# Altium schematic sheet Main.SchDoc: Main
size A3; Author: Arjan Blankestijn; Revision: V1; SheetNumber: 1; SheetTotal: 2; Author2: Bram Bremer; Team: 2024; ProjectPrettyName: BMS; Subsystem: Module Board
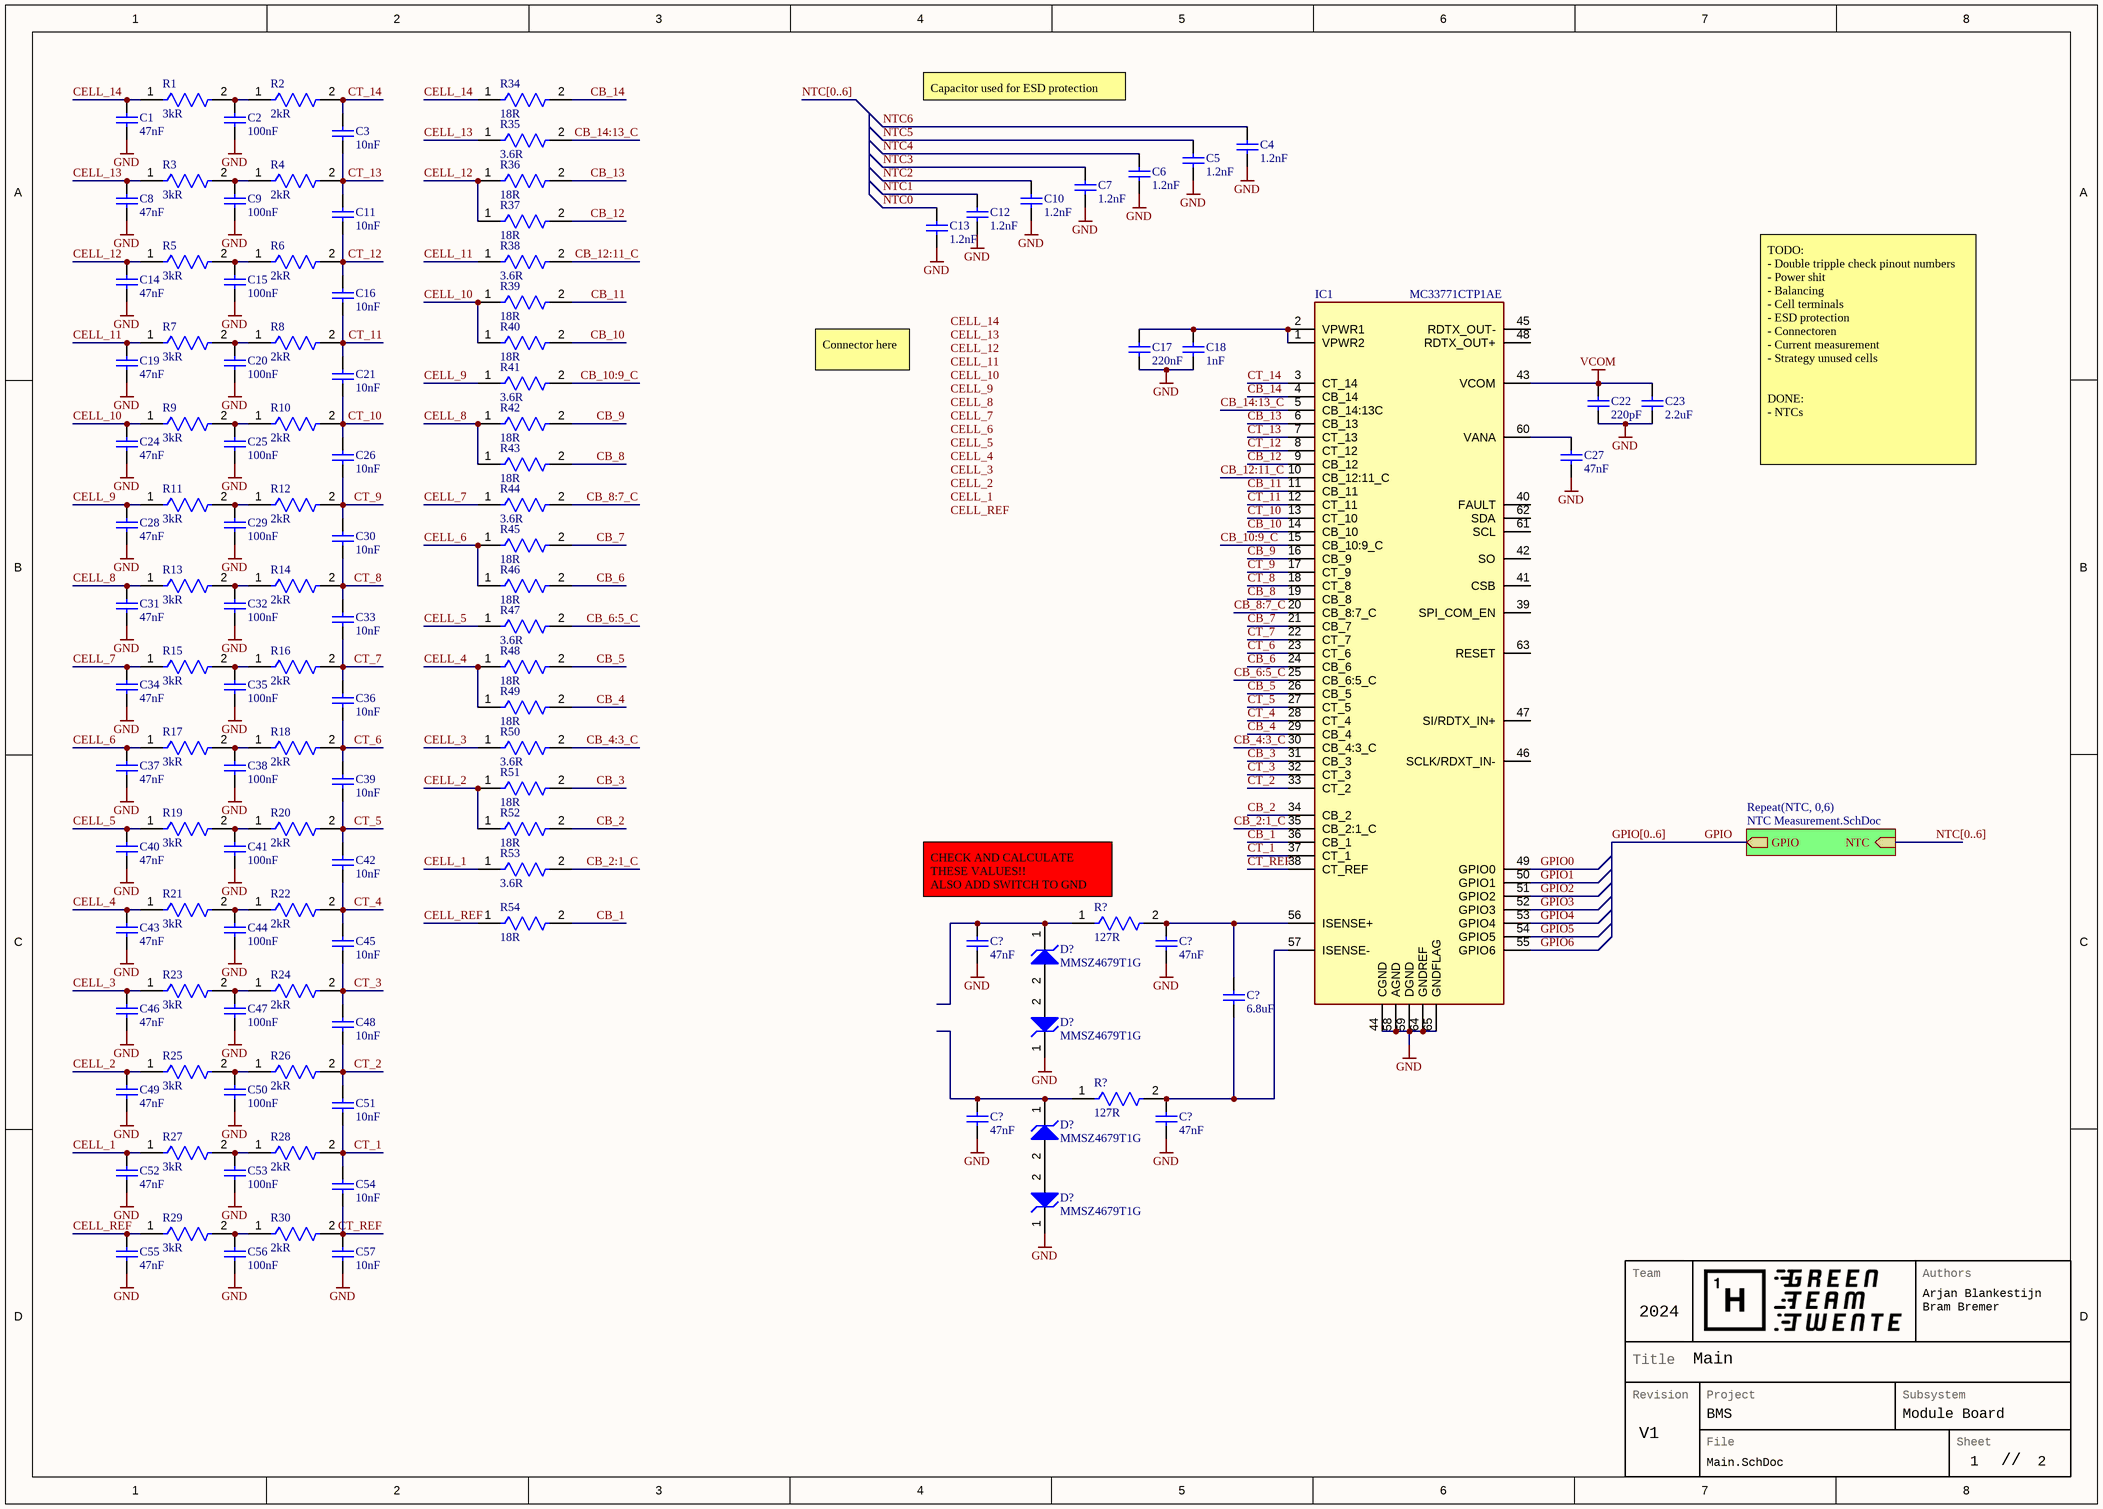
[diagram p0: Main.SchDoc]

## Parts
(Parts that share a designator on the sheet are numbered #1, #2 ... from top to bottom, then left to right.)
C1  value 47nF  [WCAP-CSGP_0402_L1W0.5H0.5]  (hidden comment: 47nF 0402 C_NTC)
C2  value 100nF  [WCAP-CSGP_0402_L1W0.5H0.5]  (hidden comment: 100nF 0402 C_NTC)
C3  value 10nF  [WCAP-CSGP_0402_L1W0.5H0.5]  (hidden comment: 10nF 0402 C_NTC)
C4  value 1.2nF  [WCAP-CSGP_0402_L1W0.5H0.5]  (hidden comment: 1.2nF 0402 C_NTC)
C5  value 1.2nF  [WCAP-CSGP_0402_L1W0.5H0.5]  (hidden comment: 1.2nF 0402 C_NTC)
C6  value 1.2nF  [WCAP-CSGP_0402_L1W0.5H0.5]  (hidden comment: 1.2nF 0402 C_NTC)
C7  value 1.2nF  [WCAP-CSGP_0402_L1W0.5H0.5]  (hidden comment: 1.2nF 0402 C_NTC)
C8  value 47nF  [WCAP-CSGP_0402_L1W0.5H0.5]  (hidden comment: 47nF 0402 C_NTC)
C9  value 100nF  [WCAP-CSGP_0402_L1W0.5H0.5]  (hidden comment: 100nF 0402 C_NTC)
C10  value 1.2nF  [WCAP-CSGP_0402_L1W0.5H0.5]  (hidden comment: 1.2nF 0402 C_NTC)
C11  value 10nF  [WCAP-CSGP_0402_L1W0.5H0.5]  (hidden comment: 10nF 0402 C_NTC)
C12  value 1.2nF  [WCAP-CSGP_0402_L1W0.5H0.5]  (hidden comment: 1.2nF 0402 C_NTC)
C13  value 1.2nF  [WCAP-CSGP_0402_L1W0.5H0.5]  (hidden comment: 1.2nF 0402 C_NTC)
C14  value 47nF  [WCAP-CSGP_0402_L1W0.5H0.5]  (hidden comment: 47nF 0402 C_NTC)
C15  value 100nF  [WCAP-CSGP_0402_L1W0.5H0.5]  (hidden comment: 100nF 0402 C_NTC)
C16  value 10nF  [WCAP-CSGP_0402_L1W0.5H0.5]  (hidden comment: 10nF 0402 C_NTC)
C17  value 220nF  [WCAP-CSGP_0402_L1W0.5H0.5]  (hidden comment: 220nF 0402 C_NTC)
C18  value 1nF  [WCAP-CSGP_0402_L1W0.5H0.5]  (hidden comment: 1nF 0402 C_NTC)
C19  value 47nF  [WCAP-CSGP_0402_L1W0.5H0.5]  (hidden comment: 47nF 0402 C_NTC)
C20  value 100nF  [WCAP-CSGP_0402_L1W0.5H0.5]  (hidden comment: 100nF 0402 C_NTC)
C21  value 10nF  [WCAP-CSGP_0402_L1W0.5H0.5]  (hidden comment: 10nF 0402 C_NTC)
C22  value 220pF  [WCAP-CSGP_0402_L1W0.5H0.5]  (hidden comment: 220pF 0402 C_NTC)
C23  value 2.2uF  [WCAP-CSGP_0402_L1W0.5H0.5]  (hidden comment: 2.2uF 0402 C_NTC)
C24  value 47nF  [WCAP-CSGP_0402_L1W0.5H0.5]  (hidden comment: 47nF 0402 C_NTC)
C25  value 100nF  [WCAP-CSGP_0402_L1W0.5H0.5]  (hidden comment: 100nF 0402 C_NTC)
C26  value 10nF  [WCAP-CSGP_0402_L1W0.5H0.5]  (hidden comment: 10nF 0402 C_NTC)
C27  value 47nF  [WCAP-CSGP_0402_L1W0.5H0.5]  (hidden comment: 47nF 0402 C_NTC)
C28  value 47nF  [WCAP-CSGP_0402_L1W0.5H0.5]  (hidden comment: 47nF 0402 C_NTC)
C29  value 100nF  [WCAP-CSGP_0402_L1W0.5H0.5]  (hidden comment: 100nF 0402 C_NTC)
C30  value 10nF  [WCAP-CSGP_0402_L1W0.5H0.5]  (hidden comment: 10nF 0402 C_NTC)
C31  value 47nF  [WCAP-CSGP_0402_L1W0.5H0.5]  (hidden comment: 47nF 0402 C_NTC)
C32  value 100nF  [WCAP-CSGP_0402_L1W0.5H0.5]  (hidden comment: 100nF 0402 C_NTC)
C33  value 10nF  [WCAP-CSGP_0402_L1W0.5H0.5]  (hidden comment: 10nF 0402 C_NTC)
C34  value 47nF  [WCAP-CSGP_0402_L1W0.5H0.5]  (hidden comment: 47nF 0402 C_NTC)
C35  value 100nF  [WCAP-CSGP_0402_L1W0.5H0.5]  (hidden comment: 100nF 0402 C_NTC)
C36  value 10nF  [WCAP-CSGP_0402_L1W0.5H0.5]  (hidden comment: 10nF 0402 C_NTC)
C37  value 47nF  [WCAP-CSGP_0402_L1W0.5H0.5]  (hidden comment: 47nF 0402 C_NTC)
C38  value 100nF  [WCAP-CSGP_0402_L1W0.5H0.5]  (hidden comment: 100nF 0402 C_NTC)
C39  value 10nF  [WCAP-CSGP_0402_L1W0.5H0.5]  (hidden comment: 10nF 0402 C_NTC)
C40  value 47nF  [WCAP-CSGP_0402_L1W0.5H0.5]  (hidden comment: 47nF 0402 C_NTC)
C41  value 100nF  [WCAP-CSGP_0402_L1W0.5H0.5]  (hidden comment: 100nF 0402 C_NTC)
C42  value 10nF  [WCAP-CSGP_0402_L1W0.5H0.5]  (hidden comment: 10nF 0402 C_NTC)
C43  value 47nF  [WCAP-CSGP_0402_L1W0.5H0.5]  (hidden comment: 47nF 0402 C_NTC)
C44  value 100nF  [WCAP-CSGP_0402_L1W0.5H0.5]  (hidden comment: 100nF 0402 C_NTC)
C45  value 10nF  [WCAP-CSGP_0402_L1W0.5H0.5]  (hidden comment: 10nF 0402 C_NTC)
C46  value 47nF  [WCAP-CSGP_0402_L1W0.5H0.5]  (hidden comment: 47nF 0402 C_NTC)
C47  value 100nF  [WCAP-CSGP_0402_L1W0.5H0.5]  (hidden comment: 100nF 0402 C_NTC)
C48  value 10nF  [WCAP-CSGP_0402_L1W0.5H0.5]  (hidden comment: 10nF 0402 C_NTC)
C49  value 47nF  [WCAP-CSGP_0402_L1W0.5H0.5]  (hidden comment: 47nF 0402 C_NTC)
C50  value 100nF  [WCAP-CSGP_0402_L1W0.5H0.5]  (hidden comment: 100nF 0402 C_NTC)
C51  value 10nF  [WCAP-CSGP_0402_L1W0.5H0.5]  (hidden comment: 10nF 0402 C_NTC)
C52  value 47nF  [WCAP-CSGP_0402_L1W0.5H0.5]  (hidden comment: 47nF 0402 C_NTC)
C53  value 100nF  [WCAP-CSGP_0402_L1W0.5H0.5]  (hidden comment: 100nF 0402 C_NTC)
C54  value 10nF  [WCAP-CSGP_0402_L1W0.5H0.5]  (hidden comment: 10nF 0402 C_NTC)
C55  value 47nF  [WCAP-CSGP_0402_L1W0.5H0.5]  (hidden comment: 47nF 0402 C_NTC)
C56  value 100nF  [WCAP-CSGP_0402_L1W0.5H0.5]  (hidden comment: 100nF 0402 C_NTC)
C57  value 10nF  [WCAP-CSGP_0402_L1W0.5H0.5]  (hidden comment: 10nF 0402 C_NTC)
C?#1  value 47nF  [WCAP-CSGP_0402_L1W0.5H0.5]  (hidden comment: 47nF 0402 C_NTC)
C?#2  value 47nF  [WCAP-CSGP_0402_L1W0.5H0.5]  (hidden comment: 47nF 0402 C_NTC)
C?#3  value 6.8uF  [WCAP-CSGP_0402_L1W0.5H0.5]  (hidden comment: 6.8uF 0402 C_NTC)
C?#4  value 47nF  [WCAP-CSGP_0402_L1W0.5H0.5]  (hidden comment: 47nF 0402 C_NTC)
C?#5  value 47nF  [WCAP-CSGP_0402_L1W0.5H0.5]  (hidden comment: 47nF 0402 C_NTC)
D?#1  MMSZ4679T1G  [ONSC-SOD-123-2-425-04_V]
D?#2  MMSZ4679T1G  [ONSC-SOD-123-2-425-04_V]
D?#3  MMSZ4679T1G  [ONSC-SOD-123-2-425-04_V]
D?#4  MMSZ4679T1G  [ONSC-SOD-123-2-425-04_V]
IC1  MC33771CTP1AE  [QFP50P1200X1200X160-65N]
R1  Resistance: 3kR  [FP-RT0402-0_35-MFG]  (hidden comment: 3kR 0402 0.1%)
R2  Resistance: 2kR  [FP-RT0402-0_35-MFG]  (hidden comment: 2kR 0402 0.1%)
R3  Resistance: 3kR  [FP-RT0402-0_35-MFG]  (hidden comment: 3kR 0402 0.1%)
R4  Resistance: 2kR  [FP-RT0402-0_35-MFG]  (hidden comment: 2kR 0402 0.1%)
R5  Resistance: 3kR  [FP-RT0402-0_35-MFG]  (hidden comment: 3kR 0402 0.1%)
R6  Resistance: 2kR  [FP-RT0402-0_35-MFG]  (hidden comment: 2kR 0402 0.1%)
R7  Resistance: 3kR  [FP-RT0402-0_35-MFG]  (hidden comment: 3kR 0402 0.1%)
R8  Resistance: 2kR  [FP-RT0402-0_35-MFG]  (hidden comment: 2kR 0402 0.1%)
R9  Resistance: 3kR  [FP-RT0402-0_35-MFG]  (hidden comment: 3kR 0402 0.1%)
R10  Resistance: 2kR  [FP-RT0402-0_35-MFG]  (hidden comment: 2kR 0402 0.1%)
R11  Resistance: 3kR  [FP-RT0402-0_35-MFG]  (hidden comment: 3kR 0402 0.1%)
R12  Resistance: 2kR  [FP-RT0402-0_35-MFG]  (hidden comment: 2kR 0402 0.1%)
R13  Resistance: 3kR  [FP-RT0402-0_35-MFG]  (hidden comment: 3kR 0402 0.1%)
R14  Resistance: 2kR  [FP-RT0402-0_35-MFG]  (hidden comment: 2kR 0402 0.1%)
R15  Resistance: 3kR  [FP-RT0402-0_35-MFG]  (hidden comment: 3kR 0402 0.1%)
R16  Resistance: 2kR  [FP-RT0402-0_35-MFG]  (hidden comment: 2kR 0402 0.1%)
R17  Resistance: 3kR  [FP-RT0402-0_35-MFG]  (hidden comment: 3kR 0402 0.1%)
R18  Resistance: 2kR  [FP-RT0402-0_35-MFG]  (hidden comment: 2kR 0402 0.1%)
R19  Resistance: 3kR  [FP-RT0402-0_35-MFG]  (hidden comment: 3kR 0402 0.1%)
R20  Resistance: 2kR  [FP-RT0402-0_35-MFG]  (hidden comment: 2kR 0402 0.1%)
R21  Resistance: 3kR  [FP-RT0402-0_35-MFG]  (hidden comment: 3kR 0402 0.1%)
R22  Resistance: 2kR  [FP-RT0402-0_35-MFG]  (hidden comment: 2kR 0402 0.1%)
R23  Resistance: 3kR  [FP-RT0402-0_35-MFG]  (hidden comment: 3kR 0402 0.1%)
R24  Resistance: 2kR  [FP-RT0402-0_35-MFG]  (hidden comment: 2kR 0402 0.1%)
R25  Resistance: 3kR  [FP-RT0402-0_35-MFG]  (hidden comment: 3kR 0402 0.1%)
R26  Resistance: 2kR  [FP-RT0402-0_35-MFG]  (hidden comment: 2kR 0402 0.1%)
R27  Resistance: 3kR  [FP-RT0402-0_35-MFG]  (hidden comment: 3kR 0402 0.1%)
R28  Resistance: 2kR  [FP-RT0402-0_35-MFG]  (hidden comment: 2kR 0402 0.1%)
R29  Resistance: 3kR  [FP-RT0402-0_35-MFG]  (hidden comment: 3kR 0402 0.1%)
R30  Resistance: 2kR  [FP-RT0402-0_35-MFG]  (hidden comment: 2kR 0402 0.1%)
R34  Resistance: 18R  [FP-RT0402-0_35-MFG]  (hidden comment: 18R 0402 0.1%)
R35  Resistance: 3.6R  [FP-RT0402-0_35-MFG]  (hidden comment: 3.6R 0402 0.1%)
R36  Resistance: 18R  [FP-RT0402-0_35-MFG]  (hidden comment: 18R 0402 0.1%)
R37  Resistance: 18R  [FP-RT0402-0_35-MFG]  (hidden comment: 18R 0402 0.1%)
R38  Resistance: 3.6R  [FP-RT0402-0_35-MFG]  (hidden comment: 3.6R 0402 0.1%)
R39  Resistance: 18R  [FP-RT0402-0_35-MFG]  (hidden comment: 18R 0402 0.1%)
R40  Resistance: 18R  [FP-RT0402-0_35-MFG]  (hidden comment: 18R 0402 0.1%)
R41  Resistance: 3.6R  [FP-RT0402-0_35-MFG]  (hidden comment: 3.6R 0402 0.1%)
R42  Resistance: 18R  [FP-RT0402-0_35-MFG]  (hidden comment: 18R 0402 0.1%)
R43  Resistance: 18R  [FP-RT0402-0_35-MFG]  (hidden comment: 18R 0402 0.1%)
R44  Resistance: 3.6R  [FP-RT0402-0_35-MFG]  (hidden comment: 3.6R 0402 0.1%)
R45  Resistance: 18R  [FP-RT0402-0_35-MFG]  (hidden comment: 18R 0402 0.1%)
R46  Resistance: 18R  [FP-RT0402-0_35-MFG]  (hidden comment: 18R 0402 0.1%)
R47  Resistance: 3.6R  [FP-RT0402-0_35-MFG]  (hidden comment: 3.6R 0402 0.1%)
R48  Resistance: 18R  [FP-RT0402-0_35-MFG]  (hidden comment: 18R 0402 0.1%)
R49  Resistance: 18R  [FP-RT0402-0_35-MFG]  (hidden comment: 18R 0402 0.1%)
R50  Resistance: 3.6R  [FP-RT0402-0_35-MFG]  (hidden comment: 3.6R 0402 0.1%)
R51  Resistance: 18R  [FP-RT0402-0_35-MFG]  (hidden comment: 18R 0402 0.1%)
R52  Resistance: 18R  [FP-RT0402-0_35-MFG]  (hidden comment: 18R 0402 0.1%)
R53  Resistance: 3.6R  [FP-RT0402-0_35-MFG]  (hidden comment: 3.6R 0402 0.1%)
R54  Resistance: 18R  [FP-RT0402-0_35-MFG]  (hidden comment: 18R 0402 0.1%)
R?#1  Resistance: 127R  [FP-RT0402-0_35-MFG]  (hidden comment: 127R 0402 0.1%)
R?#2  Resistance: 127R  [FP-RT0402-0_35-MFG]  (hidden comment: 127R 0402 0.1%)

## Sub-sheets
Repeat(NTC, 0,6) = NTC Measurement.SchDoc: GPIO (out), NTC (in)

## Nets
GND: C1.1 C2.1 C4.1 C5.1 C6.1 C7.1 C8.1 C9.1 C10.1 C12.1 C13.1 C14.1 C15.1 C17.1 C18.1 C19.1 C20.1 C22.1 C23.1 C24.1 C25.1 C27.1 C28.1 C29.1 C31.1 C32.1 C34.1 C35.1 C37.1 C38.1 C40.1 C41.1 C43.1 C44.1 C46.1 C47.1 C49.1 C50.1 C52.1 C53.1 C55.1 C56.1 C57.1 C?#1.1 C?#2.1 C?#4.1 C?#5.1 D?#2.1(K) D?#4.1(K) IC1.44(CGND) IC1.58(AGND) IC1.59(DGND) IC1.64(GNDREF) IC1.65(GNDFLAG)
VCOM: C22.2 C23.2 IC1.43(VCOM)
CB_1: IC1.36(CB_1) R54.2
CB_2: IC1.34(CB_2) R52.2
CB_2:1_C: IC1.35(CB_2:1_C) R53.2
CB_3: IC1.31(CB_3) R51.2
CB_4: IC1.29(CB_4) R49.2
CB_4:3_C: IC1.30(CB_4:3_C) R50.2
CB_5: IC1.26(CB_5) R48.2
CB_6: IC1.24(CB_6) R46.2
CB_6:5_C: IC1.25(CB_6:5_C) R47.2
CB_7: IC1.21(CB_7) R45.2
CB_8: IC1.19(CB_8) R43.2
CB_8:7_C: IC1.20(CB_8:7_C) R44.2
CB_9: IC1.16(CB_9) R42.2
CB_10: IC1.14(CB_10) R40.2
CB_10:9_C: IC1.15(CB_10:9_C) R41.2
CB_11: IC1.11(CB_11) R39.2
CB_12: IC1.9(CB_12) R37.2
CB_12:11_C: IC1.10(CB_12:11_C) R38.2
CB_13: IC1.6(CB_13) R36.2
CB_14: IC1.4(CB_14) R34.2
CB_14:13_C: IC1.5(CB_14:13C) R35.2
CELL_1: C52.2 R27.1 R53.1
CELL_2: C49.2 R25.1 R51.1 R52.1
CELL_3: C46.2 R23.1 R50.1
CELL_4: C43.2 R21.1 R48.1 R49.1
CELL_5: C40.2 R19.1 R47.1
CELL_6: C37.2 R17.1 R45.1 R46.1
CELL_7: C34.2 R15.1 R44.1
CELL_8: C31.2 R13.1 R42.1 R43.1
CELL_9: C28.2 R11.1 R41.1
CELL_10: C24.2 R9.1 R39.1 R40.1
CELL_11: C19.2 R7.1 R38.1
CELL_12: C14.2 R5.1 R36.1 R37.1
CELL_13: C8.2 R3.1 R35.1
CELL_14: C1.2 R1.1 R34.1
CELL_REF: C55.2 R29.1 R54.1
CT_1: C51.1 C54.2 IC1.37(CT_1) R28.2
CT_2: C48.1 C51.2 IC1.33(CT_2) R26.2
CT_3: C45.1 C48.2 IC1.32(CT_3) R24.2
CT_4: C42.1 C45.2 IC1.28(CT_4) R22.2
CT_5: C39.1 C42.2 IC1.27(CT_5) R20.2
CT_6: C36.1 C39.2 IC1.23(CT_6) R18.2
CT_7: C33.1 C36.2 IC1.22(CT_7) R16.2
CT_8: C30.1 C33.2 IC1.18(CT_8) R14.2
CT_9: C26.1 C30.2 IC1.17(CT_9) R12.2
CT_10: C21.1 C26.2 IC1.13(CT_10) R10.2
CT_11: C16.1 C21.2 IC1.12(CT_11) R8.2
CT_12: C11.1 C16.2 IC1.8(CT_12) R6.2
CT_13: C3.1 C11.2 IC1.7(CT_13) R4.2
CT_14: C3.2 IC1.3(CT_14) R2.2
CT_REF: C54.1 C57.2 IC1.38(CT_REF) R30.2
GPIO: sheet Repeat(NTC, 0,6)/GPIO
GPIO0: IC1.49(GPIO0)
GPIO1: IC1.50(GPIO1)
GPIO2: IC1.51(GPIO2)
GPIO3: IC1.52(GPIO3)
GPIO4: IC1.53(GPIO4)
GPIO5: IC1.54(GPIO5)
GPIO6: IC1.55(GPIO6)
NTC0: C13.2
NTC1: C12.2
NTC2: C10.2
NTC3: C7.2
NTC4: C6.2
NTC5: C5.2
NTC6: C4.2
NetC2_2: C2.2 R1.2 R2.1
NetC9_2: C9.2 R3.2 R4.1
NetC15_2: C15.2 R5.2 R6.1
NetC17_2: C17.2 C18.2 IC1.1(VPWR2) IC1.2(VPWR1)
NetC20_2: C20.2 R7.2 R8.1
NetC25_2: C25.2 R9.2 R10.1
NetC27_2: C27.2 IC1.60(VANA)
NetC29_2: C29.2 R11.2 R12.1
NetC32_2: C32.2 R13.2 R14.1
NetC35_2: C35.2 R15.2 R16.1
NetC38_2: C38.2 R17.2 R18.1
NetC41_2: C41.2 R19.2 R20.1
NetC44_2: C44.2 R21.2 R22.1
NetC47_2: C47.2 R23.2 R24.1
NetC50_2: C50.2 R25.2 R26.1
NetC53_2: C53.2 R27.2 R28.1
NetC56_2: C56.2 R29.2 R30.1
NetC?#1_2: C?#1.2 D?#1.1(K) R?#1.1
NetC?#2_2: C?#2.2 C?#3.2 IC1.56(ISENSE+) R?#1.2
NetC?#3_1: C?#3.1 C?#5.2 IC1.57(ISENSE-) R?#2.2
NetC?#4_2: C?#4.2 D?#3.1(K) R?#2.1
NetD?#1_2: D?#1.2(A) D?#2.2(A)
NetD?#3_2: D?#3.2(A) D?#4.2(A)

Not connected (* = marked no-connect by the designer): IC1 39(SPI_COM_EN) 40(FAULT) 41(CSB) 42(SO) 45(RDTX_OUT-) 46(SCLK/RDXT_IN-) 47(SI/RDTX_IN+) 48(RDTX_OUT+) 61(SCL) 62(SDA) 63(RESET)

## Buses and harness runs
bus GPIO[0..6]
bus NTC[0..6]

## Notes on the sheet
- Capacitor used for ESD protection
- Connector here
- TODO:
  - Double tripple check pinout numbers
  - Power shit
  - Balancing
  - Cell terminals
  - ESD protection
  - Connectoren
  - Current measurement
  - Strategy unused cells
  DONE:
  - NTCs
- CHECK AND CALCULATE THESE VALUES!!
  ALSO ADD SWITCH TO GND
- Labels drawn without touching a wire or pin: CELL_1, CELL_2, CELL_3, CELL_4, CELL_5, CELL_6, CELL_7, CELL_8, CELL_9, CELL_10, CELL_11, CELL_12, CELL_13, CELL_14, CELL_REF
- Team
- Authors
- Revision
- Title
- Project
- Subsystem
- File
- Sheet
- //

## Library data of the parts
C1 C8 C14 C19 C24 C27 C28 C31 C34 C37 C40 C43 C46 C49 C52 C55 C?#1 C?#2 C?#4 C?#5 = CMP-001-00864-1: WCAP-CSGP Multilayer Ceramic Chip Capacitor, General Purpose, size 0402, X7R, 47nF, 50VDC; Manufacturer Part Number: 885012205092; Manufacturer: Wurth Elektronik; Dissipation Factor: 10%; Technical Reference: X7R0402104J050DFCT10000; Rated Voltage (DC): 50V; Capacitance Tolerance: +/-5%; Insulation Resistance: 0.5GO; Ceramic Type: X7R; Design Item ID: 885012205092; Operating Temperature Max: 125°C; Width: 0.5mm; ComponentLink2URL: https://www.we-online.com/redexpert/spec/885012205092?ad; Match Code: WCAP-CSGP; Mount: Surface Mount; ComponentLink1Description: Website Link; Height: 0.5mm; Component Type: Standard; Category: Multilayer Ceramic Chip Capacitors; ComponentLink1URL: https://www.we-online.com/redexpert/article/885012205092?ad; Source: WCAP-CSGP.SchLib; Packaging: Tape and Reel; Pins: 2; ComponentLink2Description: Datasheet Link; Operating Temperature Min: -55°C; Length: 1mm; Case/Package: 0402
C2 C9 C15 C20 C25 C29 C32 C35 C38 C41 C44 C47 C50 C53 C56 = CMP-001-00864-1: WCAP-CSGP Multilayer Ceramic Chip Capacitor, General Purpose, size 0402, X7R, 100nF, 50VDC; Manufacturer Part Number: 885012205092; Manufacturer: Wurth Elektronik; Dissipation Factor: 10%; Technical Reference: X7R0402104J050DFCT10000; Rated Voltage (DC): 50V; Capacitance Tolerance: +/-5%; Insulation Resistance: 0.5GO; Ceramic Type: X7R; Design Item ID: 885012205092; Operating Temperature Max: 125°C; Width: 0.5mm; ComponentLink2URL: https://www.we-online.com/redexpert/spec/885012205092?ad; Match Code: WCAP-CSGP; Mount: Surface Mount; ComponentLink1Description: Website Link; Height: 0.5mm; Component Type: Standard; Category: Multilayer Ceramic Chip Capacitors; ComponentLink1URL: https://www.we-online.com/redexpert/article/885012205092?ad; Source: WCAP-CSGP.SchLib; Packaging: Tape and Reel; Pins: 2; ComponentLink2Description: Datasheet Link; Operating Temperature Min: -55°C; Length: 1mm; Case/Package: 0402
C3 C11 C16 C21 C26 C30 C33 C36 C39 C42 C45 C48 C51 C54 C57 = CMP-001-00864-1: WCAP-CSGP Multilayer Ceramic Chip Capacitor, General Purpose, size 0402, X7R, 10nF, 50VDC; Manufacturer Part Number: 885012205092; Manufacturer: Wurth Elektronik; Dissipation Factor: 10%; Technical Reference: X7R0402104J050DFCT10000; Rated Voltage (DC): 50V; Capacitance Tolerance: +/-5%; Insulation Resistance: 0.5GO; Ceramic Type: X7R; Design Item ID: 885012205092; Operating Temperature Max: 125°C; Width: 0.5mm; ComponentLink2URL: https://www.we-online.com/redexpert/spec/885012205092?ad; Match Code: WCAP-CSGP; Mount: Surface Mount; ComponentLink1Description: Website Link; Height: 0.5mm; Component Type: Standard; Category: Multilayer Ceramic Chip Capacitors; ComponentLink1URL: https://www.we-online.com/redexpert/article/885012205092?ad; Source: WCAP-CSGP.SchLib; Packaging: Tape and Reel; Pins: 2; ComponentLink2Description: Datasheet Link; Operating Temperature Min: -55°C; Length: 1mm; Case/Package: 0402
C4-C7 C10 C12 C13 = CMP-001-00864-1: WCAP-CSGP Multilayer Ceramic Chip Capacitor, General Purpose, size 0402, X7R, 1.2nF, 50VDC; Manufacturer Part Number: 885012205092; Manufacturer: Wurth Elektronik; Dissipation Factor: 10%; Technical Reference: X7R0402104J050DFCT10000; Rated Voltage (DC): 50V; Capacitance Tolerance: +/-5%; Insulation Resistance: 0.5GO; Ceramic Type: X7R; Design Item ID: 885012205092; Operating Temperature Max: 125°C; Width: 0.5mm; ComponentLink2URL: https://www.we-online.com/redexpert/spec/885012205092?ad; Match Code: WCAP-CSGP; Mount: Surface Mount; ComponentLink1Description: Website Link; Height: 0.5mm; Component Type: Standard; Category: Multilayer Ceramic Chip Capacitors; ComponentLink1URL: https://www.we-online.com/redexpert/article/885012205092?ad; Source: WCAP-CSGP.SchLib; Packaging: Tape and Reel; Pins: 2; ComponentLink2Description: Datasheet Link; Operating Temperature Min: -55°C; Length: 1mm; Case/Package: 0402
C17 = CMP-001-00864-1: WCAP-CSGP Multilayer Ceramic Chip Capacitor, General Purpose, size 0402, X7R,220nF, 50VDC; Manufacturer Part Number: 885012205092; Manufacturer: Wurth Elektronik; Dissipation Factor: 10%; Technical Reference: X7R0402104J050DFCT10000; Rated Voltage (DC): 50V; Capacitance Tolerance: +/-5%; Insulation Resistance: 0.5GO; Ceramic Type: X7R; Design Item ID: 885012205092; Operating Temperature Max: 125°C; Width: 0.5mm; ComponentLink2URL: https://www.we-online.com/redexpert/spec/885012205092?ad; Match Code: WCAP-CSGP; Mount: Surface Mount; ComponentLink1Description: Website Link; Height: 0.5mm; Component Type: Standard; Category: Multilayer Ceramic Chip Capacitors; ComponentLink1URL: https://www.we-online.com/redexpert/article/885012205092?ad; Source: WCAP-CSGP.SchLib; Packaging: Tape and Reel; Pins: 2; ComponentLink2Description: Datasheet Link; Operating Temperature Min: -55°C; Length: 1mm; Case/Package: 0402
C18 = CMP-001-00864-1: WCAP-CSGP Multilayer Ceramic Chip Capacitor, General Purpose, size 0402, X7R,1nF, 50VDC; Manufacturer Part Number: 885012205092; Manufacturer: Wurth Elektronik; Dissipation Factor: 10%; Technical Reference: X7R0402104J050DFCT10000; Rated Voltage (DC): 50V; Capacitance Tolerance: +/-5%; Insulation Resistance: 0.5GO; Ceramic Type: X7R; Design Item ID: 885012205092; Operating Temperature Max: 125°C; Width: 0.5mm; ComponentLink2URL: https://www.we-online.com/redexpert/spec/885012205092?ad; Match Code: WCAP-CSGP; Mount: Surface Mount; ComponentLink1Description: Website Link; Height: 0.5mm; Component Type: Standard; Category: Multilayer Ceramic Chip Capacitors; ComponentLink1URL: https://www.we-online.com/redexpert/article/885012205092?ad; Source: WCAP-CSGP.SchLib; Packaging: Tape and Reel; Pins: 2; ComponentLink2Description: Datasheet Link; Operating Temperature Min: -55°C; Length: 1mm; Case/Package: 0402
C22 = CMP-001-00864-1: WCAP-CSGP Multilayer Ceramic Chip Capacitor, General Purpose, size 0402, X7R,220pF, 50VDC; Manufacturer Part Number: 885012205092; Manufacturer: Wurth Elektronik; Dissipation Factor: 10%; Technical Reference: X7R0402104J050DFCT10000; Rated Voltage (DC): 50V; Capacitance Tolerance: +/-5%; Insulation Resistance: 0.5GO; Ceramic Type: X7R; Design Item ID: 885012205092; Operating Temperature Max: 125°C; Width: 0.5mm; ComponentLink2URL: https://www.we-online.com/redexpert/spec/885012205092?ad; Match Code: WCAP-CSGP; Mount: Surface Mount; ComponentLink1Description: Website Link; Height: 0.5mm; Component Type: Standard; Category: Multilayer Ceramic Chip Capacitors; ComponentLink1URL: https://www.we-online.com/redexpert/article/885012205092?ad; Source: WCAP-CSGP.SchLib; Packaging: Tape and Reel; Pins: 2; ComponentLink2Description: Datasheet Link; Operating Temperature Min: -55°C; Length: 1mm; Case/Package: 0402
C23 = CMP-001-00864-1: WCAP-CSGP Multilayer Ceramic Chip Capacitor, General Purpose, size 0402, X7R,2.2uF, 50VDC; Manufacturer Part Number: 885012205092; Manufacturer: Wurth Elektronik; Dissipation Factor: 10%; Technical Reference: X7R0402104J050DFCT10000; Rated Voltage (DC): 50V; Capacitance Tolerance: +/-5%; Insulation Resistance: 0.5GO; Ceramic Type: X7R; Design Item ID: 885012205092; Operating Temperature Max: 125°C; Width: 0.5mm; ComponentLink2URL: https://www.we-online.com/redexpert/spec/885012205092?ad; Match Code: WCAP-CSGP; Mount: Surface Mount; ComponentLink1Description: Website Link; Height: 0.5mm; Component Type: Standard; Category: Multilayer Ceramic Chip Capacitors; ComponentLink1URL: https://www.we-online.com/redexpert/article/885012205092?ad; Source: WCAP-CSGP.SchLib; Packaging: Tape and Reel; Pins: 2; ComponentLink2Description: Datasheet Link; Operating Temperature Min: -55°C; Length: 1mm; Case/Package: 0402
C?#3 = CMP-001-00864-1: WCAP-CSGP Multilayer Ceramic Chip Capacitor, General Purpose, size 0402, X7R, 6.8uF, 50VDC; Manufacturer Part Number: 885012205092; Manufacturer: Wurth Elektronik; Dissipation Factor: 10%; Technical Reference: X7R0402104J050DFCT10000; Rated Voltage (DC): 50V; Capacitance Tolerance: +/-5%; Insulation Resistance: 0.5GO; Ceramic Type: X7R; Design Item ID: 885012205092; Operating Temperature Max: 125°C; Width: 0.5mm; ComponentLink2URL: https://www.we-online.com/redexpert/spec/885012205092?ad; Match Code: WCAP-CSGP; Mount: Surface Mount; ComponentLink1Description: Website Link; Height: 0.5mm; Component Type: Standard; Category: Multilayer Ceramic Chip Capacitors; ComponentLink1URL: https://www.we-online.com/redexpert/article/885012205092?ad; Source: WCAP-CSGP.SchLib; Packaging: Tape and Reel; Pins: 2; ComponentLink2Description: Datasheet Link; Operating Temperature Min: -55°C; Length: 1mm; Case/Package: 0402
D?#1-D?#4 = CMP-1060-00509-1: Zener Voltage Regulator, 500 mW, 2-Pin SOD-123, Pb-Free, Tape and Reel; Manufacturer: On Semiconductor; P Max (W): 0.5; VZ Typ (V): 2; Packing: Tape and Reel; ComponentLink1Description: Manufacturer URL; DatasheetVersion: Rev. 9; PackageReference: SOD-123-2-425-04; ComponentLink3URL: http://www.onsemi.com/pub_link/Collateral/425-04.PDF; PackageDescription: 2-Pin SOD, Body 1.6 x 2.69 mm; ComponentLink3Description: Package Specification; ComponentLink2Description: Datasheet; ComponentLink1URL: http://www.onsemi.com/; PartNumber: MMSZ4679T1G; RoHS: Pb-Free; PackageVersion: Rev. G, 10/2009; ComponentLink2URL: http://www.onsemi.com/pub_link/Collateral/MMSZ4678T1-D.PDF; Mounting Technology: Surface Mount
IC1 = CMP-031-00033-2: Integrated Circuit; Manufacturer_Name: NXP; Design Item ID: MC33771CTP1AE; Arrow Part Number: MC33771CTP1AE; Mouser Price/Stock: https://www.mouser.co.uk/ProductDetail/NXP-Semiconductors/MC33771CTP1AE?qs=wnTfsH77Xs56aES1BMo%252B4w%3D%3D; Arrow Price/Stock: https://www.arrow.com/en/products/mc33771ctp1ae/nxp-semiconductors?region=europe; Height: 1.6mm; Source: TempSchematics.schlib; Datasheet Link: https://eu.mouser.com/datasheet/2/302/PB_MC33771C-1949877.pdf; Manufacturer_Part_Number: MC33771CTP1AE; Mouser Part Number: 771-MC33771CTP1AE
R1 R3 R5 R7 R9 R11 R13 R15 R17 R19 R21 R23 R25 R27 R29 = CMP-2002-02972-3: RES SMD 3K OHM 0.1% 1/16W 0402; Temperature Coefficient: 50ppm/°C; Voltage Rating (DC): 50V; Max Power Dissipation: 63mW; Number of Terminations: 2; Construction: Rectangular; Series: RT; Length: 0.039inch; Case Code (Metric): 1005; Military Standard: Not; Height: 0.014inch; Features: Moisture Resistant; Package Quantity: 10000; Case/Package: 0402; Lead Free: Lead Free; Width: 0.02inch; RoHS Compliant: Yes; Tolerance: 0.1%; Case Code (Imperial): 0402; Size Code: 0402; Depth: 0.5mm; Min Operating Temperature: -55°C; Max Operating Temperature: 155°C; Resistor Type: Thin Film; Power Rating: 63mW; Packaging: Tape and Reel
R2 R4 R6 R8 R10 R12 R14 R16 R18 R20 R22 R24 R26 R28 R30 = CMP-2002-02972-3: RES SMD 2K OHM 0.1% 1/16W 0402; Temperature Coefficient: 50ppm/°C; Voltage Rating (DC): 50V; Max Power Dissipation: 63mW; Number of Terminations: 2; Construction: Rectangular; Series: RT; Length: 0.039inch; Case Code (Metric): 1005; Military Standard: Not; Height: 0.014inch; Features: Moisture Resistant; Package Quantity: 10000; Case/Package: 0402; Lead Free: Lead Free; Width: 0.02inch; RoHS Compliant: Yes; Tolerance: 0.1%; Case Code (Imperial): 0402; Size Code: 0402; Depth: 0.5mm; Min Operating Temperature: -55°C; Max Operating Temperature: 155°C; Resistor Type: Thin Film; Power Rating: 63mW; Packaging: Tape and Reel
R34 R36 R37 R39 R40 R42 R43 R45 R46 R48 R49 R51 R52 R54 = CMP-2002-02972-3: RES SMD 18 OHM 0.1% 1/16W 0402; Temperature Coefficient: 50ppm/°C; Voltage Rating (DC): 50V; Max Power Dissipation: 63mW; Number of Terminations: 2; Construction: Rectangular; Series: RT; Length: 0.039inch; Case Code (Metric): 1005; Military Standard: Not; Height: 0.014inch; Features: Moisture Resistant; Package Quantity: 10000; Case/Package: 0402; Lead Free: Lead Free; Width: 0.02inch; RoHS Compliant: Yes; Tolerance: 0.1%; Case Code (Imperial): 0402; Size Code: 0402; Depth: 0.5mm; Min Operating Temperature: -55°C; Max Operating Temperature: 155°C; Resistor Type: Thin Film; Power Rating: 63mW; Packaging: Tape and Reel
R35 R38 R41 R44 R47 R50 R53 = CMP-2002-02972-3: RES SMD 3.6 OHM 0.1% 1/16W 0402; Temperature Coefficient: 50ppm/°C; Voltage Rating (DC): 50V; Max Power Dissipation: 63mW; Number of Terminations: 2; Construction: Rectangular; Series: RT; Length: 0.039inch; Case Code (Metric): 1005; Military Standard: Not; Height: 0.014inch; Features: Moisture Resistant; Package Quantity: 10000; Case/Package: 0402; Lead Free: Lead Free; Width: 0.02inch; RoHS Compliant: Yes; Tolerance: 0.1%; Case Code (Imperial): 0402; Size Code: 0402; Depth: 0.5mm; Min Operating Temperature: -55°C; Max Operating Temperature: 155°C; Resistor Type: Thin Film; Power Rating: 63mW; Packaging: Tape and Reel
R?#1 R?#2 = CMP-2002-02972-3: RES SMD 127 OHM 0.1% 1/16W 0402; Temperature Coefficient: 50ppm/°C; Voltage Rating (DC): 50V; Max Power Dissipation: 63mW; Number of Terminations: 2; Construction: Rectangular; Series: RT; Length: 0.039inch; Case Code (Metric): 1005; Military Standard: Not; Height: 0.014inch; Features: Moisture Resistant; Package Quantity: 10000; Case/Package: 0402; Lead Free: Lead Free; Width: 0.02inch; RoHS Compliant: Yes; Tolerance: 0.1%; Case Code (Imperial): 0402; Size Code: 0402; Depth: 0.5mm; Min Operating Temperature: -55°C; Max Operating Temperature: 155°C; Resistor Type: Thin Film; Power Rating: 63mW; Packaging: Tape and Reel